# Altium schematic sheet main.SchDoc
size A4
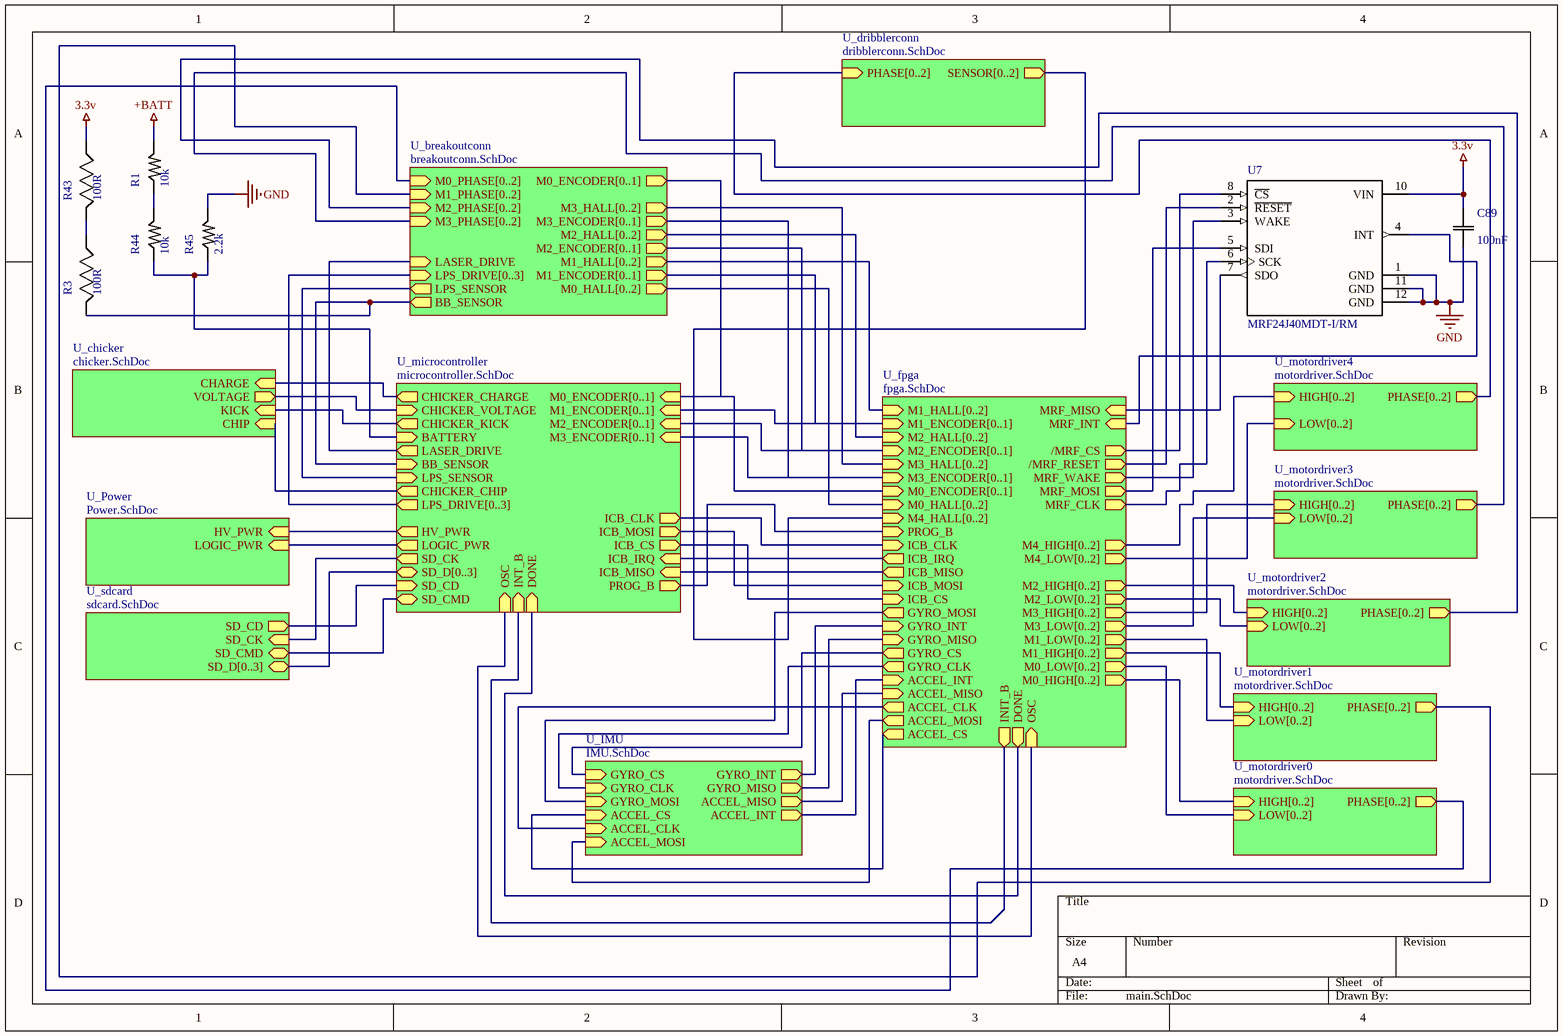
[diagram p0: main.SchDoc]

## Parts
C89  100nF  [CAPC2013X110N]
R1  10k  [RESC2012X60]
R3  100R  [RESC2012X60]
R43  100R  [RESC2012X60]
R44  10k  [RESC2012X60]
R45  2.2k  [RESC2012X60]
U7  MRF24J40MDT-I/RM  [XCVR_MRF24J40MDT-I/RM]

## Sub-sheets
U_breakoutconn = breakoutconn.SchDoc: BB_SENSOR (out), LPS_SENSOR (out), M3_HALL[0..2] (out), M3_ENCODER[0..1] (out), M2_HALL[0..2] (out), M2_ENCODER[0..1] (out), M1_HALL[0..2] (out), M1_ENCODER[0..1] (out), M0_HALL[0..2] (out), M0_ENCODER[0..1] (out), LPS_DRIVE[0..3] (in), M2_PHASE[0..2] (in), M3_PHASE[0..2] (in), LASER_DRIVE (in), M0_PHASE[0..2] (in), M1_PHASE[0..2] (in)
U_chicker = chicker.SchDoc: CHARGE (in), CHIP (in), KICK (in), VOLTAGE (out)
U_dribblerconn = dribblerconn.SchDoc: PHASE[0..2] (in), SENSOR[0..2] (out)
U_fpga = fpga.SchDoc: M1_HALL[0..2] (in), M1_ENCODER[0..1] (in), M2_HALL[0..2] (in), M2_ENCODER[0..1] (in), M3_HALL[0..2] (in), M3_ENCODER[0..1] (in), ACCEL_INT (in), ACCEL_CS (out), ACCEL_MISO (in), ACCEL_MOSI (out), ACCEL_CLK (out), MRF_MISO (in), /MRF_CS (out), /MRF_RESET (out), MRF_WAKE (out), MRF_INT (in), MRF_MOSI (out), MRF_CLK (out), M0_ENCODER[0..1] (in), M0_HALL[0..2] (in), GYRO_INT (in), GYRO_CS (out), GYRO_CLK (out), GYRO_MISO (in), M4_HIGH[0..2] (out), M4_LOW[0..2] (out), GYRO_MOSI (out), M2_HIGH[0..2] (out), M2_LOW[0..2] (out), M3_HIGH[0..2] (out), M3_LOW[0..2] (out), M4_HALL[0..2] (in), M1_LOW[0..2] (out), M1_HIGH[0..2] (out), M0_LOW[0..2] (out), M0_HIGH[0..2] (out), PROG_B (in), ICB_CS (in), INIT_B (out), ICB_IRQ (out), DONE (out), ICB_CLK (in), ICB_MOSI (in), ICB_MISO (out), OSC (in)
U_IMU = IMU.SchDoc: GYRO_CS (in), GYRO_CLK (in), GYRO_MOSI (in), GYRO_INT (out), GYRO_MISO (out), ACCEL_CS (in), ACCEL_CLK (in), ACCEL_MOSI (in), ACCEL_MISO (out), ACCEL_INT (out)
U_microcontroller = microcontroller.SchDoc: HV_PWR (out), LOGIC_PWR (out), OSC (in), LPS_DRIVE[0..3] (out), BATTERY (in), CHICKER_VOLTAGE (in), M3_ENCODER[0..1] (in), CHICKER_CHIP (out), DONE (in), ICB_CLK (out), ICB_MISO (in), ICB_MOSI (out), BB_SENSOR (in), LPS_SENSOR (in), ICB_IRQ (in), INT_B (in), ICB_CS (out), PROG_B (out), M2_ENCODER[0..1] (in), SD_D[0..3] (bidir), SD_CD (in), LASER_DRIVE (out), SD_CK (out), SD_CMD (bidir), M0_ENCODER[0..1] (in), M1_ENCODER[0..1] (in), CHICKER_KICK (out), CHICKER_CHARGE (out)
U_motordriver0 = motordriver.SchDoc: HIGH[0..2] (in), LOW[0..2] (in), PHASE[0..2] (out)
U_motordriver1 = motordriver.SchDoc: HIGH[0..2] (in), LOW[0..2] (in), PHASE[0..2] (out)
U_motordriver2 = motordriver.SchDoc: HIGH[0..2] (in), LOW[0..2] (in), PHASE[0..2] (out)
U_motordriver3 = motordriver.SchDoc: HIGH[0..2] (in), LOW[0..2] (in), PHASE[0..2] (out)
U_motordriver4 = motordriver.SchDoc: HIGH[0..2] (in), LOW[0..2] (in), PHASE[0..2] (out)
U_Power = Power.SchDoc: LOGIC_PWR (in), HV_PWR (in)
U_sdcard = sdcard.SchDoc: SD_D[0..3] (bidir), SD_CMD (bidir), SD_CK (in), SD_CD (out)

## Nets
3.3v: C89.2(C2) R43.2 U7.10(VIN)
+BATT: R1.2
GND: C89.1(C1) R45.2 U7.1(GND) U7.11(GND) U7.12(GND)
NetR1_1: R1.1 R44.2
NetR3_1: R3.1 ; sheet U_breakoutconn/BB_SENSOR, sheet U_microcontroller/BB_SENSOR
NetR3_2: R3.2 R43.1
NetR44_1: R44.1 R45.1 ; sheet U_microcontroller/BATTERY
NetU7_2: U7.2(~{RESET}) ; sheet U_fpga//MRF_RESET
NetU7_3: U7.3(WAKE) ; sheet U_fpga/MRF_WAKE
NetU7_4: U7.4(INT) ; sheet U_fpga/MRF_INT
NetU7_5: U7.5(SDI) ; sheet U_fpga/MRF_MOSI
NetU7_6: U7.6(SCK) ; sheet U_fpga/MRF_CLK
NetU7_7: U7.7(SDO) ; sheet U_fpga/MRF_MISO
NetU7_8: U7.8(~{CS}) ; sheet U_fpga//MRF_CS
(unnamed): sheet U_fpga/ACCEL_INT, sheet U_IMU/ACCEL_INT
(unnamed): sheet U_fpga/ACCEL_CS, sheet U_IMU/ACCEL_CS
(unnamed): sheet U_fpga/ACCEL_MISO, sheet U_IMU/ACCEL_MISO
(unnamed): sheet U_fpga/ACCEL_MOSI, sheet U_IMU/ACCEL_MOSI
(unnamed): sheet U_fpga/ACCEL_CLK, sheet U_IMU/ACCEL_CLK
(unnamed): sheet U_fpga/GYRO_INT, sheet U_IMU/GYRO_INT
(unnamed): sheet U_fpga/GYRO_CS, sheet U_IMU/GYRO_CS
(unnamed): sheet U_fpga/GYRO_CLK, sheet U_IMU/GYRO_CLK
(unnamed): sheet U_fpga/GYRO_MISO, sheet U_IMU/GYRO_MISO
(unnamed): sheet U_fpga/GYRO_MOSI, sheet U_IMU/GYRO_MOSI
(unnamed): sheet U_fpga/PROG_B, sheet U_microcontroller/PROG_B
(unnamed): sheet U_fpga/ICB_CS, sheet U_microcontroller/ICB_CS
(unnamed): sheet U_fpga/INIT_B, sheet U_microcontroller/INT_B
(unnamed): sheet U_fpga/ICB_IRQ, sheet U_microcontroller/ICB_IRQ
(unnamed): sheet U_fpga/DONE, sheet U_microcontroller/DONE
(unnamed): sheet U_fpga/ICB_CLK, sheet U_microcontroller/ICB_CLK
(unnamed): sheet U_fpga/ICB_MOSI, sheet U_microcontroller/ICB_MOSI
(unnamed): sheet U_fpga/ICB_MISO, sheet U_microcontroller/ICB_MISO
(unnamed): sheet U_fpga/OSC, sheet U_microcontroller/OSC
(unnamed): sheet U_Power/LOGIC_PWR, sheet U_microcontroller/LOGIC_PWR
(unnamed): sheet U_Power/HV_PWR, sheet U_microcontroller/HV_PWR
(unnamed): sheet U_sdcard/SD_CMD, sheet U_microcontroller/SD_CMD
(unnamed): sheet U_sdcard/SD_CK, sheet U_microcontroller/SD_CK
(unnamed): sheet U_sdcard/SD_CD, sheet U_microcontroller/SD_CD
(unnamed): sheet U_breakoutconn/LPS_SENSOR, sheet U_microcontroller/LPS_SENSOR
(unnamed): sheet U_breakoutconn/LASER_DRIVE, sheet U_microcontroller/LASER_DRIVE
(unnamed): sheet U_chicker/CHARGE, sheet U_microcontroller/CHICKER_CHARGE
(unnamed): sheet U_chicker/CHIP, sheet U_microcontroller/CHICKER_CHIP
(unnamed): sheet U_chicker/KICK, sheet U_microcontroller/CHICKER_KICK
(unnamed): sheet U_chicker/VOLTAGE, sheet U_microcontroller/CHICKER_VOLTAGE

## Buses and harness runs
bus sheet U_breakoutconn/LPS_DRIVE[0..3] = sheet U_microcontroller/LPS_DRIVE[0..3]
bus sheet U_breakoutconn/M0_ENCODER[0..1] = sheet U_fpga/M0_ENCODER[0..1] = sheet U_microcontroller/M0_ENCODER[0..1]
bus sheet U_breakoutconn/M0_HALL[0..2] = sheet U_fpga/M0_HALL[0..2]
bus sheet U_breakoutconn/M0_PHASE[0..2] = sheet U_motordriver0/PHASE[0..2]
bus sheet U_breakoutconn/M1_ENCODER[0..1] = sheet U_fpga/M1_ENCODER[0..1] = sheet U_microcontroller/M1_ENCODER[0..1]
bus sheet U_breakoutconn/M1_HALL[0..2] = sheet U_fpga/M1_HALL[0..2]
bus sheet U_breakoutconn/M1_PHASE[0..2] = sheet U_motordriver1/PHASE[0..2]
bus sheet U_breakoutconn/M2_ENCODER[0..1] = sheet U_fpga/M2_ENCODER[0..1] = sheet U_microcontroller/M2_ENCODER[0..1]
bus sheet U_breakoutconn/M2_HALL[0..2] = sheet U_fpga/M2_HALL[0..2]
bus sheet U_breakoutconn/M2_PHASE[0..2] = sheet U_motordriver2/PHASE[0..2]
bus sheet U_breakoutconn/M3_ENCODER[0..1] = sheet U_fpga/M3_ENCODER[0..1] = sheet U_microcontroller/M3_ENCODER[0..1]
bus sheet U_breakoutconn/M3_HALL[0..2] = sheet U_fpga/M3_HALL[0..2]
bus sheet U_breakoutconn/M3_PHASE[0..2] = sheet U_motordriver3/PHASE[0..2]
bus sheet U_dribblerconn/PHASE[0..2] = sheet U_motordriver4/PHASE[0..2]
bus sheet U_dribblerconn/SENSOR[0..2] = sheet U_fpga/M4_HALL[0..2]
bus sheet U_fpga/M0_HIGH[0..2] = sheet U_motordriver0/HIGH[0..2]
bus sheet U_fpga/M0_LOW[0..2] = sheet U_motordriver0/LOW[0..2]
bus sheet U_fpga/M1_HIGH[0..2] = sheet U_motordriver1/HIGH[0..2]
bus sheet U_fpga/M1_LOW[0..2] = sheet U_motordriver1/LOW[0..2]
bus sheet U_fpga/M2_HIGH[0..2] = sheet U_motordriver2/HIGH[0..2]
bus sheet U_fpga/M2_LOW[0..2] = sheet U_motordriver2/LOW[0..2]
bus sheet U_fpga/M3_HIGH[0..2] = sheet U_motordriver3/HIGH[0..2]
bus sheet U_fpga/M3_LOW[0..2] = sheet U_motordriver3/LOW[0..2]
bus sheet U_fpga/M4_HIGH[0..2] = sheet U_motordriver4/HIGH[0..2]
bus sheet U_fpga/M4_LOW[0..2] = sheet U_motordriver4/LOW[0..2]
bus sheet U_microcontroller/SD_D[0..3] = sheet U_sdcard/SD_D[0..3]

## Library data of the parts
C89 = C0805C104K5RACTU: Capacitor; Ceramic; Cap; .100UF ; Tol+-10%; SMD; Vol-Rtg 50V; X7R, Tape/Reel; MF: Kemet; Package: 0805 Kemet; MP: C0805C104K5RACTU; Value: *
R1 R44 R45 = RC0805FR-0710KL: RES SMD 10K OHM 1% 1/8W 0805; MF: Yageo; Package: 0805 Yageo; MP: RC0805FR-0710KL; Value: *
R3 R43 = RC0805FR-07100RL: RES SMD 100 OHM 1% 1/8W 0805; MF: Yageo; MP: RC0805FR-07100RL; Package: 0805 Yageo; Value: *
U7 = MRF24J40MDT-I/RM: 2.4 GHz IEEE 802.15.4 Certified Transceiver Module (+20 dBm), 12 MODULE Varies T/R; MF: Microchip; MP: MRF24J40MDT-I/RM; Package: SMD-12 Microchip; Value: *